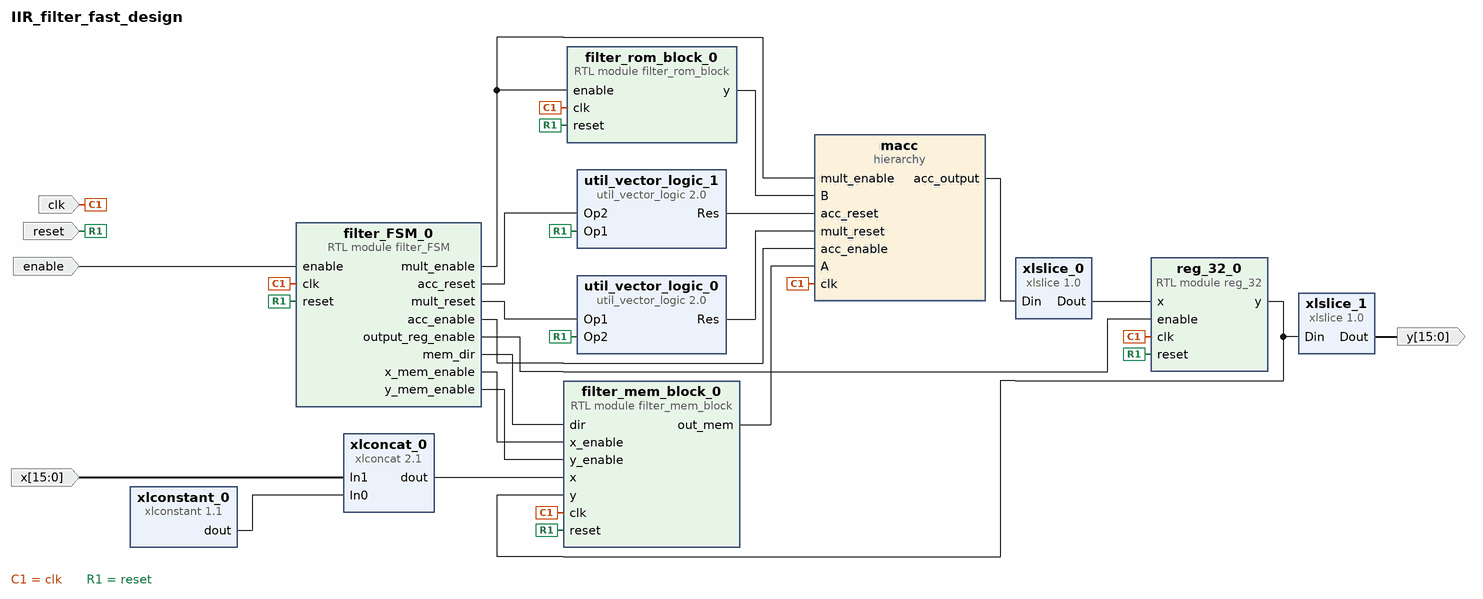
[diagram p0: block diagram of the top level]
# Vivado block design IIR_filter_fast_design, xc7a200tfbg676-2, Vivado 2022.1
create_bd_design IIR_filter_fast_design

create_bd_port -dir I clk
create_bd_port -dir I enable
create_bd_port -dir I reset
create_bd_port -dir I -from 15 -to 0 -type data x
create_bd_port -dir O -from 15 -to 0 -type data y

create_bd_cell -type module -reference filter_FSM filter_FSM_0
create_bd_cell -type module -reference filter_mem_block filter_mem_block_0
create_bd_cell -type module -reference filter_rom_block filter_rom_block_0
create_bd_cell -type hier macc
create_bd_cell -type module -reference reg_32 reg_32_0
create_bd_cell -type ip -vlnv xilinx.com:ip:util_vector_logic:2.0 util_vector_logic_0
set_property -dict {CONFIG.C_OPERATION or CONFIG.C_SIZE 1} [get_bd_cells util_vector_logic_0]
create_bd_cell -type ip -vlnv xilinx.com:ip:util_vector_logic:2.0 util_vector_logic_1
set_property -dict {CONFIG.C_OPERATION or CONFIG.C_SIZE 1} [get_bd_cells util_vector_logic_1]
create_bd_cell -type ip -vlnv xilinx.com:ip:xlconcat:2.1 xlconcat_0
set_property -dict {CONFIG.IN0_WIDTH 16 CONFIG.IN1_WIDTH 16} [get_bd_cells xlconcat_0]
create_bd_cell -type ip -vlnv xilinx.com:ip:xlconstant:1.1 xlconstant_0
set_property -dict {CONFIG.CONST_VAL 0 CONFIG.CONST_WIDTH 16} [get_bd_cells xlconstant_0]
create_bd_cell -type ip -vlnv xilinx.com:ip:xlslice:1.0 xlslice_0
set_property -dict {CONFIG.DIN_FROM 47 CONFIG.DIN_TO 16 CONFIG.DIN_WIDTH 48 CONFIG.DOUT_WIDTH 32} [get_bd_cells xlslice_0]
create_bd_cell -type ip -vlnv xilinx.com:ip:xlslice:1.0 xlslice_1
set_property -dict {CONFIG.DIN_FROM 31 CONFIG.DIN_TO 16 CONFIG.DOUT_WIDTH 16} [get_bd_cells xlslice_1]

# ---- hierarchy /macc ----
current_bd_instance /macc
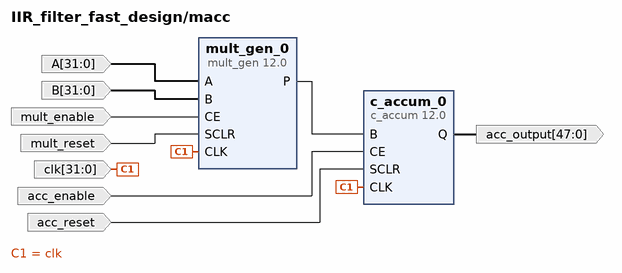
[diagram p1: block diagram inside /macc]
create_bd_pin -dir I -from 31 -to 0 -type data A
create_bd_pin -dir I -from 31 -to 0 -type data B
create_bd_pin -dir I acc_enable
create_bd_pin -dir O -from 47 -to 0 -type data acc_output
create_bd_pin -dir I acc_reset
create_bd_pin -dir I -from 31 -to 0 -type clk clk
create_bd_pin -dir I mult_enable
create_bd_pin -dir I mult_reset

create_bd_cell -type ip -vlnv xilinx.com:ip:c_accum:12.0 c_accum_0
set_property -dict [list \
  CONFIG.Bypass false \
  CONFIG.CE true \
  CONFIG.Implementation DSP48 \
  CONFIG.Input_Type Signed \
  CONFIG.Input_Width 48 \
  CONFIG.Latency 1 \
  CONFIG.Latency_Configuration Manual \
  CONFIG.Output_Width 48 \
  CONFIG.SCLR true \
] [get_bd_cells c_accum_0]
create_bd_cell -type ip -vlnv xilinx.com:ip:mult_gen:12.0 mult_gen_0
set_property -dict [list \
  CONFIG.ClockEnable true \
  CONFIG.MultType Parallel_Multiplier \
  CONFIG.Multiplier_Construction Use_Mults \
  CONFIG.OptGoal Speed \
  CONFIG.OutputWidthHigh 47 \
  CONFIG.PortAWidth 32 \
  CONFIG.PortBWidth 32 \
  CONFIG.SyncClear true \
  CONFIG.Use_Custom_Output_Width true \
] [get_bd_cells mult_gen_0]

# ---- connections ----

current_bd_instance /macc
connect_bd_net [get_bd_pins A] [get_bd_pins mult_gen_0/A]
connect_bd_net [get_bd_pins B] [get_bd_pins mult_gen_0/B]
connect_bd_net [get_bd_pins acc_enable] [get_bd_pins c_accum_0/CE]
connect_bd_net [get_bd_pins acc_reset] [get_bd_pins c_accum_0/SCLR]
connect_bd_net [get_bd_pins c_accum_0/Q] [get_bd_pins acc_output]
connect_bd_net [get_bd_pins clk] [get_bd_pins c_accum_0/CLK] [get_bd_pins mult_gen_0/CLK]
connect_bd_net [get_bd_pins mult_enable] [get_bd_pins mult_gen_0/CE]
connect_bd_net [get_bd_pins mult_gen_0/P] [get_bd_pins c_accum_0/B]
connect_bd_net [get_bd_pins mult_reset] [get_bd_pins mult_gen_0/SCLR]

current_bd_instance /
connect_bd_net -net acc_reset_1 [get_bd_pins util_vector_logic_1/Res] [get_bd_pins macc/acc_reset]
connect_bd_net [get_bd_ports clk] \
  [get_bd_pins filter_FSM_0/clk] [get_bd_pins filter_mem_block_0/clk] [get_bd_pins filter_rom_block_0/clk] \
  [get_bd_pins macc/clk] [get_bd_pins reg_32_0/clk]
connect_bd_net [get_bd_ports enable] [get_bd_pins filter_FSM_0/enable]
connect_bd_net [get_bd_pins filter_FSM_0/acc_enable] [get_bd_pins macc/acc_enable]
connect_bd_net [get_bd_pins filter_FSM_0/acc_reset] [get_bd_pins util_vector_logic_1/Op2]
connect_bd_net -net filter_FSM_0_macc_enable [get_bd_pins filter_FSM_0/mult_enable] \
  [get_bd_pins filter_rom_block_0/enable] [get_bd_pins macc/mult_enable]
connect_bd_net [get_bd_pins filter_FSM_0/mem_dir] [get_bd_pins filter_mem_block_0/dir]
connect_bd_net [get_bd_pins filter_FSM_0/mult_reset] [get_bd_pins util_vector_logic_0/Op1]
connect_bd_net [get_bd_pins filter_FSM_0/output_reg_enable] [get_bd_pins reg_32_0/enable]
connect_bd_net [get_bd_pins filter_FSM_0/x_mem_enable] [get_bd_pins filter_mem_block_0/x_enable]
connect_bd_net [get_bd_pins filter_FSM_0/y_mem_enable] [get_bd_pins filter_mem_block_0/y_enable]
connect_bd_net -net filter_mem_block_0_out [get_bd_pins filter_mem_block_0/out_mem] [get_bd_pins macc/A]
connect_bd_net [get_bd_pins filter_rom_block_0/y] [get_bd_pins macc/B]
connect_bd_net [get_bd_pins macc/acc_output] [get_bd_pins xlslice_0/Din]
connect_bd_net -net mult_reset_1 [get_bd_pins util_vector_logic_0/Res] [get_bd_pins macc/mult_reset]
connect_bd_net [get_bd_pins reg_32_0/y] [get_bd_pins filter_mem_block_0/y] [get_bd_pins xlslice_1/Din]
connect_bd_net [get_bd_ports reset] \
  [get_bd_pins filter_FSM_0/reset] [get_bd_pins filter_mem_block_0/reset] [get_bd_pins filter_rom_block_0/reset] \
  [get_bd_pins reg_32_0/reset] [get_bd_pins util_vector_logic_0/Op2] [get_bd_pins util_vector_logic_1/Op1]
connect_bd_net [get_bd_ports x] [get_bd_pins xlconcat_0/In1]
connect_bd_net [get_bd_pins xlconcat_0/dout] [get_bd_pins filter_mem_block_0/x]
connect_bd_net [get_bd_pins xlconstant_0/dout] [get_bd_pins xlconcat_0/In0]
connect_bd_net [get_bd_pins xlslice_0/Dout] [get_bd_pins reg_32_0/x]
connect_bd_net [get_bd_pins xlslice_1/Dout] [get_bd_ports y]

validate_bd_design
save_bd_design
